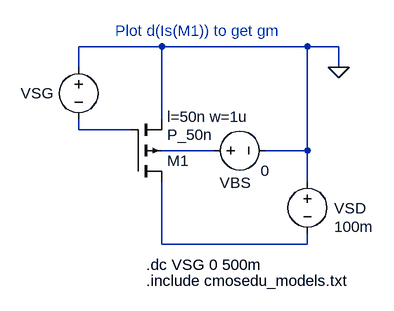
[diagram p0: schematic Fig26_18_ID_VSG.asc]
Fig26_18_ID_VSG.asc, the LTspice schematic file:
Version 4
SHEET 1 1184 688
WIRE 448 0 320 0
WIRE 672 0 448 0
WIRE 720 0 672 0
WIRE 320 32 320 0
WIRE 720 32 720 0
WIRE 448 112 448 0
WIRE 320 128 320 112
WIRE 400 128 320 128
WIRE 528 160 448 160
WIRE 672 160 672 0
WIRE 672 160 608 160
WIRE 672 208 672 160
WIRE 448 304 448 208
WIRE 672 304 672 288
WIRE 672 304 448 304
FLAG 720 32 0
SYMBOL voltage 320 16 R0
WINDOW 0 -89 56 Left 2
WINDOW 3 24 104 Invisible 2
WINDOW 123 0 0 Left 2
WINDOW 39 0 0 Left 2
SYMATTR InstName VSG
SYMATTR Value 0
SYMBOL voltage 672 192 R0
WINDOW 123 0 0 Left 2
WINDOW 39 0 0 Left 2
WINDOW 0 41 57 Left 2
WINDOW 3 41 85 Left 2
SYMATTR InstName VSD
SYMATTR Value 100m
SYMBOL voltage 512 160 M90
WINDOW 0 65 49 VBottom 2
WINDOW 3 47 95 VBottom 2
WINDOW 123 0 0 Left 2
WINDOW 39 0 0 Left 2
SYMATTR InstName VBS
SYMATTR Value 0
SYMBOL pmos4 400 208 M180
WINDOW 123 56 100 Left 2
SYMATTR Value2 l=50n w=1u
SYMATTR InstName M1
SYMATTR Value P_50n
TEXT 424 336 Left 2 !.dc VSG 0 500m
TEXT 424 360 Left 2 !.include cmosedu_models.txt
TEXT 376 -24 Left 2 ;Plot d(Is(M1)) to get gm

The netlist it stands for:
* Fig26_18_ID_VSG.asc
VSG 0 N001 0
VSD 0 N003 100m
VBS N002 0 0
M1 N003 N001 0 N002 P_50n l=50n w=1u
.model NMOS NMOS
.model PMOS PMOS
.lib standard.mos
.dc VSG 0 500m
.include cmosedu_models.txt
* Plot d(Is(M1)) to get gm
.backanno
.end